# EAGLE design sanfrancisco_barometer_rev_B (EAGLE 6.6.0)
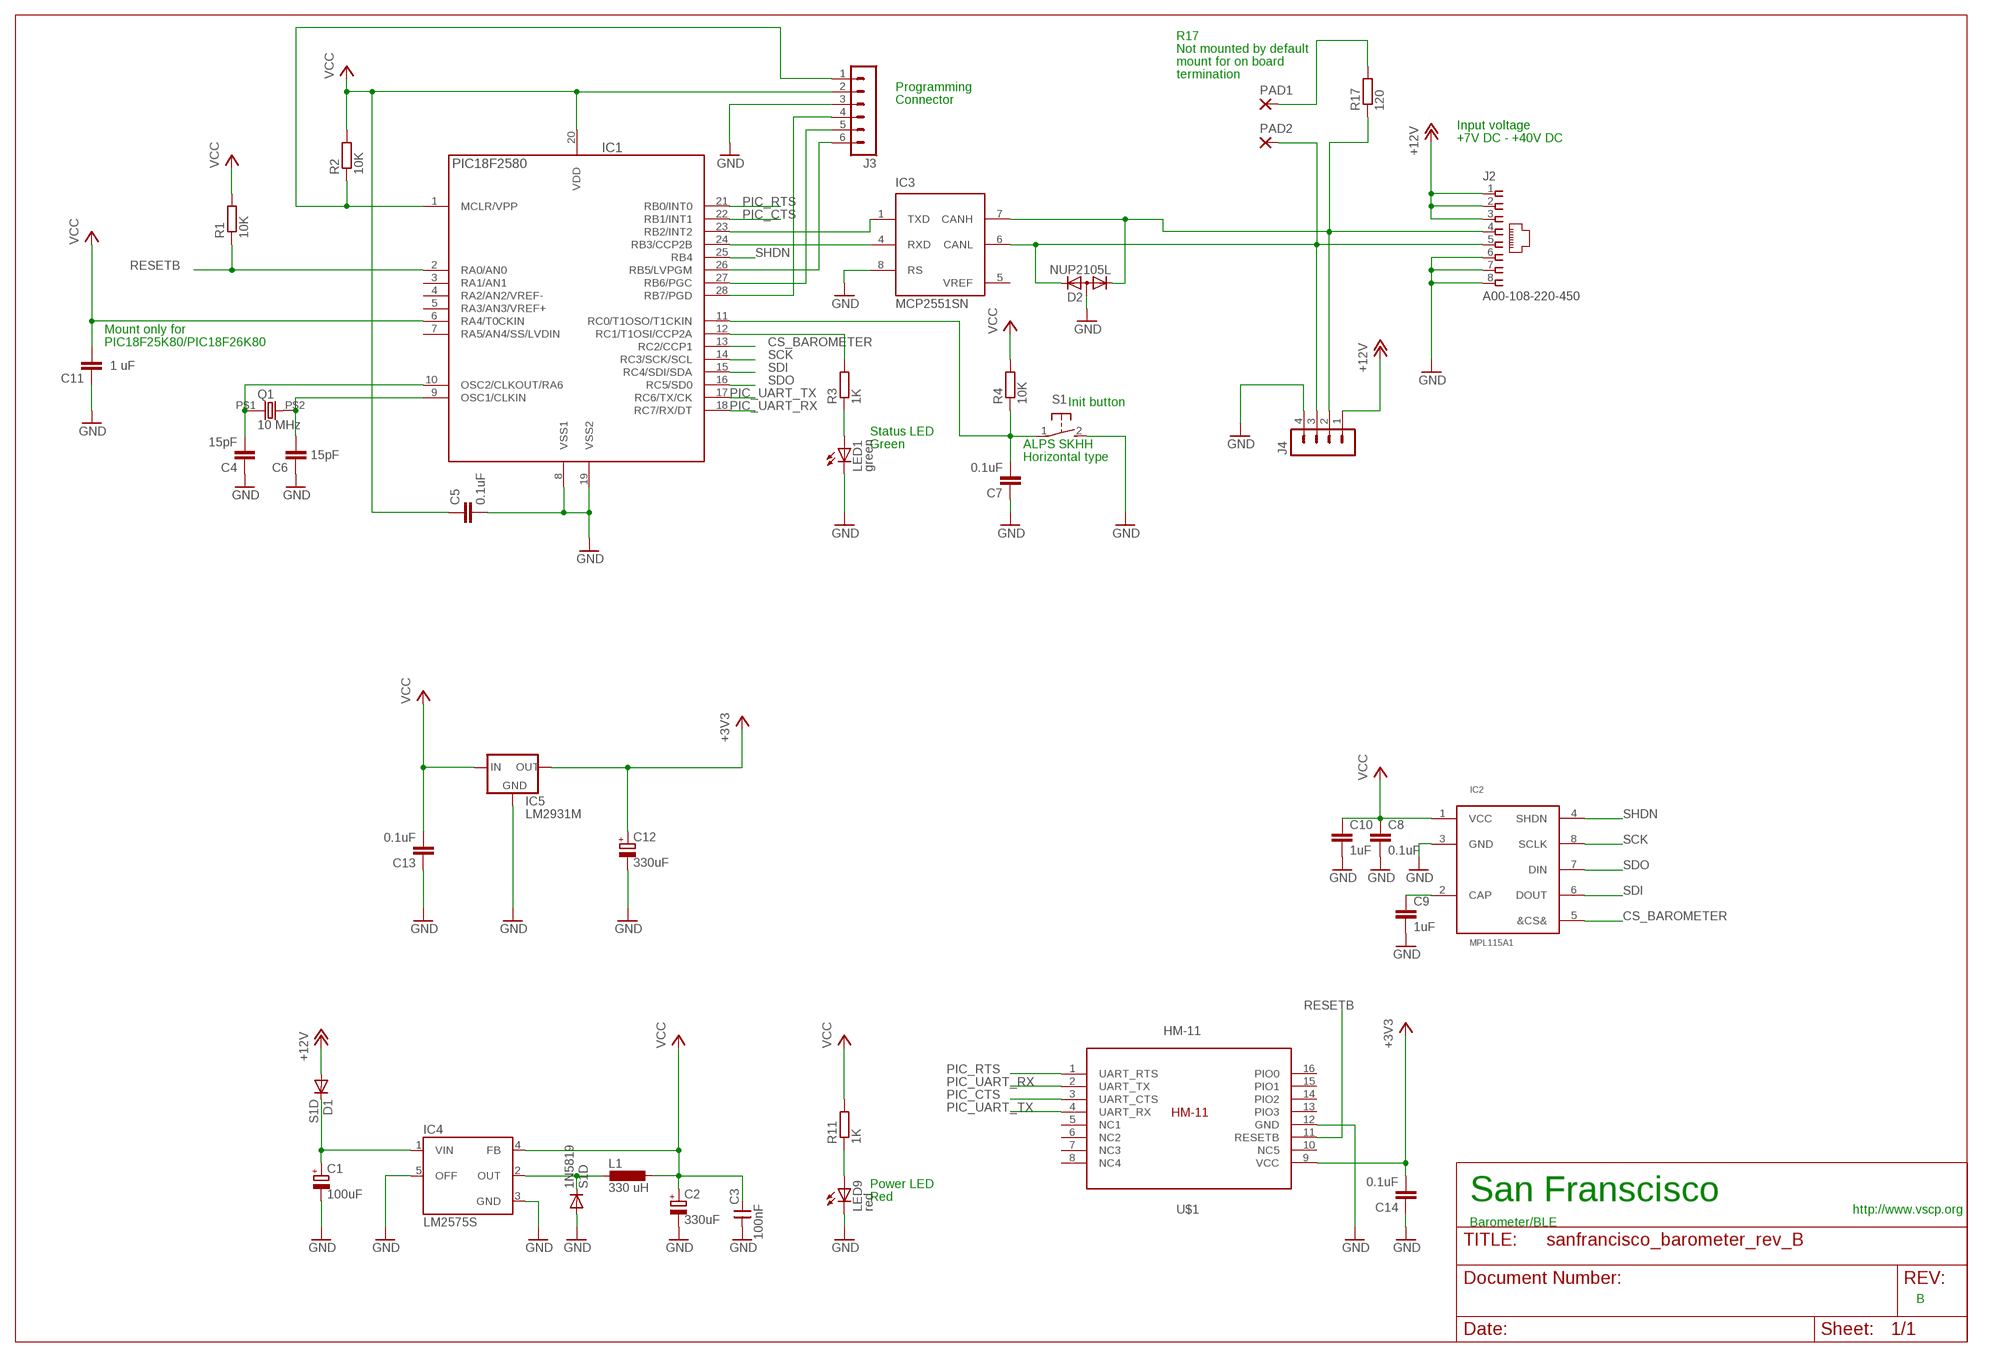
[diagram p0: schematic, sheet 1]

## Parts
1N5819  S1D  DIODE-SOD123  [SOD123]
C1  100uF  CPOL-EUD  [PANASONIC_D]
C2  330uF  CPOL-EUD  [PANASONIC_D]
C3  100nF  CNP-0805  [0805]
C4  15pF  C-EUC0805  [C0805]
C5  0.1uF  C-EUC0805  [C0805]
C6  15pF  C-EUC0805  [C0805]
C7  0.1uF  C-EUC0805  [C0805]
C8  0.1uF  C-EUC0805  [C0805]
C9  1uF  C-EUC0805  [C0805]
C10  1uF  C-EUC0805  [C0805]
C11  1 uF  C-EUC0805  [C0805]
C12  330uF  CPOL-EUD  [PANASONIC_D]
C13  0.1uF  C-EUC0805  [C0805]
C14  0.1uF  C-EUC0805  [C0805]
D1  S1D  DIODE-SOD123  [SOD123]
D2  NUP2105L  DIODE-2CA|ACSOT23  [SOT23]
IC1  PIC18F2580  PIC18LF252-I/SO  [SO28]
IC2  MPL115A1  [LGA8]
IC3  MCP2551SN  [SO-08]
IC4  LM2575S  [TO263-5]
IC5  LM2931M  [SO08]
J2  A00-108-220-450  [RJ-45]
J3  MA06-1  [MA06-1]
J4  MA04-1  [MA04-1]
L1  330 uH  DO3316P  [DO3316P]
LED1  green  LEDCHIP-LED0805  [CHIP-LED0805]
LED9  red  LEDCHIP-LED0805  [CHIP-LED0805]
PAD1  1,6/0,8  [1,6/0,8]
PAD2  1,6/0,8  [1,6/0,8]
Q1  10 MHz  HC-49S  [9C]
R1  10K  R-EU_R0805  [R0805]
R2  10K  R-EU_R0805  [R0805]
R3  1K  R-EU_R0805  [R0805]
R4  10K  R-EU_R0805  [R0805]
R11  1K  R-EU_R0805  [R0805]
R17  120  R-EU_R0805  [R0805]
S1  31-XX  [B3F-31XX]
U$1  HM-11  [HM-11]

## Nets
+3V3: C12.+ C14.2 IC5.1(OUT) U$1.9(VCC)
+12V: D1.A J2.1 J2.2 J2.3 J4.1
CANL: D2.2(K2) IC3.6(CANL) J2.5 J4.3 PAD2.1(P)
CS_BAROMETER: IC1.13(RC2/CCP1) IC2.5(&CS&)
GND: 1N5819.A C1.- C2.- C3.1 C4.1 C5.2 C6.1 C7.1 C8.2 C9.2 C10.2 C11.1 C12.- C13.1 C14.1 D2.3(A) IC1.8(VSS1) IC1.19(VSS2) IC2.3(GND) IC3.8(RS) IC4.3(GND) IC4.5(OFF) IC5.2(GND) J2.6 J2.7 J2.8 J3.3 J4.4 LED1.C LED9.C S1.2(S) U$1.12(GND)
N$1: 1N5819.C IC4.2(OUT) L1.1
N$2: C4.2 IC1.10(OSC2/CLKOUT/RA6) Q1.P$1
N$3: C1.+ D1.C IC4.1(VIN)
N$4: IC1.12(RC1/T1OSI/CCP2A) R3.2
N$5: LED1.A R3.1
N$6: C7.2 IC1.11(RC0/T1OSO/T1CKIN) R4.1 S1.1(P)
N$7: C6.2 IC1.9(OSC1/CLKIN) Q1.P$2
N$9: C9.1 IC2.2(CAP)
N$12: IC1.1(MCLR/VPP) J3.1 R2.1
N$13: IC1.28(RB7/PGD) J3.4
N$14: IC1.27(RB6/PGC) J3.5
N$15: IC1.26(RB5/LVPGM) J3.6
N$16: PAD1.1(P) R17.2
N$20: LED9.A R11.1
N$22: D2.1(K1) IC3.7(CANH) J2.4 J4.2 R17.1
PIC_CTS: IC1.22(RB1/INT1) U$1.3(UART_CTS)
PIC_RTS: IC1.21(RB0/INT0) U$1.1(UART_RTS)
PIC_UART_RX: IC1.18(RC7/RX/DT) U$1.2(UART_TX)
PIC_UART_TX: IC1.17(RC6/TX/CK) U$1.4(UART_RX)
RESETB: IC1.2(RA0/AN0) R1.1 U$1.11(RESETB)
RXCAN: IC1.24(RB3/CCP2B) IC3.4(RXD)
SCK: IC1.14(RC3/SCK/SCL) IC2.8(SCLK)
SDI: IC1.15(RC4/SDI/SDA) IC2.6(DOUT)
SDO: IC1.16(RC5/SD0) IC2.7(DIN)
SHDN: IC1.25(RB4) IC2.4(SHDN)
TXCAN: IC1.23(RB2/INT2) IC3.1(TXD)
VCC: C2.+ C3.2 C5.1 C8.1 C10.1 C11.2 C13.2 IC1.6(RA4/T0CKIN) IC1.20(VDD) IC2.1(VCC) IC4.4(FB) IC5.8(IN) J3.2 L1.2 R1.2 R2.2 R4.2 R11.2
Unconnected: IC1.3(RA1/AN1) IC1.4(RA2/AN2/VREF-) IC1.5(RA3/AN3/VREF+) IC1.7(RA5/AN4/SS/LVDIN) U$1.5(NC1) U$1.6(NC2) U$1.7(NC3) U$1.8(NC4) U$1.10(NC5) U$1.13(PIO3) U$1.14(PIO2) U$1.15(PIO1) U$1.16(PIO0)

## Notes on the sheet
- R17
- Not mounted by default
- mount for on board
- termination
- Programming
- Connector
- Input voltage
- +7V DC - +40V DC
- Mount only for
- PIC18F25K80/PIC18F26K80
- Init button
- Status LED
- Green | ALPS SKHH
- Horizontal type
- Power LED
- Red | San Franscisco
- http://www.vscp.org
- Barometer/BLE
- B

## Power pins joined to a net without a drawn wire
GND: IC3.2(VSS)
VCC: IC3.3(VDD)
VREF: IC3.5(VREF)

## Library data of the parts
1N5819 D1 = diode:DIODE-: DIODE
C1 C2 C12 = rcl:CPOL-EU: POLARIZED CAPACITOR, European symbol
C3 = cap-master:CNP-: NON-POLARIZED CAP
C4-C11 C13 C14 = rcl:C-EU: CAPACITOR, European symbol
D2 = diode:DIODE-2CA|AC: Dual DIODE Cathode-Anode|Anode-Cathode
IC1 = pic_olin:PIC18*F252-?: 18F252, 28 pin, 32Kb prog, 1536 data, 256 EEPROM
IC2 = mpl115a1:MPL115A1
IC3 = microchip_can:MCP2551: High Speed CAN tranceiver
IC4 = v-reg-3:LM2575: National Semiconductor <http://www.national.com> 1.0A "Simple Switcher"(c) 52kHz, Vout 1.23-37V (HV: 57V), Vin 40V (HV: 60V), 50µA standby current
IC5 = v-reg-3:LM2931: National Semiconductor <http://www.national.com> Low Dropout Fixed Regulator Vin up to 26V, Reverse Batterie/Load Dump/Short Circuit/Overload Protection,
J2 = vscpcan:A00-108-220-450
J3 = con-lstb:MA06-1: PIN HEADER; OC_FARNELL: unknown; OC_NEWARK: unknown
J4 = con-lstb:MA04-1: PIN HEADER; OC_FARNELL: unknown; OC_NEWARK: unknown
L1 = inductor-coilcraft:DO3316P: COILCRAFT; OC_FARNELL: unknown; OC_NEWARK: unknown
LED1 LED9 = led:LED: LED OSRAM: - CHIPLED LG R971, LG N971, LY N971, LG Q971, LY Q971, LO R971, LY R971 LH N974, LH R974 LS Q976, LO Q976, LY Q976 LO Q996 - Hyper CHIPLED LW Q18S LB Q993, LB Q99A, LB R99A - SideLED LS A670, LO A670, LY A670, LG A670, LP A670 LB A673, LV A673, LT A673, LW A673 LH A674 LY A675 LS A676, LA A676, LO A676, LY A676, LW A676 LS A679, LY A679, LG A679 - Hyper Micro SIDELED® LS Y876, LA Y876, LO Y876, LY Y876 LT Y87S - SmartLED LW L88C, LW L88S LB L89C, LB L89S, LG L890 LS L89K, LO L89K, LY L89K LS L896, LA L896, LO L896, LY L896 - TOPLED LS T670, LO T670, LY T670, LG T670, LP T670 LSG T670, LSP T670, LSY T670, LOP T670, LYG T670 LG T671, LOG T671, LSG T671 LB T673, LV T673, LT T673, LW T673 LH T674 LS T676, LA T676, LO T676, LY T676, LB T676, LH T676, LSB T676, LW T676 LB T67C, LV T67C, LT T67C, LS T67K, LO T67K, LY T67K, LW E67C LS E67B, LA E67B, LO E67B, LY E67B, LB E67C, LV E67C, LT E67C LW T67C LS T679, LY T679, LG T679 LS T770, LO T770, LY T770, LG T770, LP T770 LB T773, LV T773, LT T773, LW T773 LH T774 LS E675, LA E675, LY E675, LS T675 LS T776, LA T776, LO T776, LY T776, LB T776 LHGB T686 LT T68C, LB T68C - Hyper Mini TOPLED® LB M676 - Mini TOPLED Santana® LG M470 LS M47K, LO M47K, LY M47K Source: http://www.osram.convergy.de LUXEON: - LUMILED® LXK2-PW12-R00, LXK2-PW12-S00, LXK2-PW14-U00, LXK2-PW14-V00 LXK2-PM12-R00, LXK2-PM12-S00, LXK2-PM14-U00 LXK2-PE12-Q00, LXK2-PE12-R00, LXK2-PE12-S00, LXK2-PE14-T00, LXK2-PE14-U00 LXK2-PB12-K00, LXK2-PB12-L00, LXK2-PB12-M00, LXK2-PB14-N00, LXK2-PB14-P00, LXK2-PB14-Q00 LXK2-PR12-L00, LXK2-PR12-M00, LXK2-PR14-Q00, LXK2-PR14-R00 LXK2-PD12-Q00, LXK2-PD12-R00, LXK2-PD12-S00 LXK2-PH12-R00, LXK2-PH12-S00 LXK2-PL12-P00, LXK2-PL12-Q00, LXK2-PL12-R00 Source: www.luxeon.com KINGBRIGHT: KA-3528ASYC Source: www.kingbright.com
PAD1 PAD2 = wirepad:1,6/0,8: THROUGH-HOLE PAD
Q1 = vscpcan:HC-49S: Digikey 887-1050-1-nd
R1-R4 R11 R17 = rcl:R-EU_: RESISTOR, European symbol
S1 = switch-omron:31-XX: OMRON SWITCH; MPN: B3F-3100; OC_FARNELL: 959704; OC_NEWARK: 36M3582
U$1 = ble-hm-11:HM-11

## Board
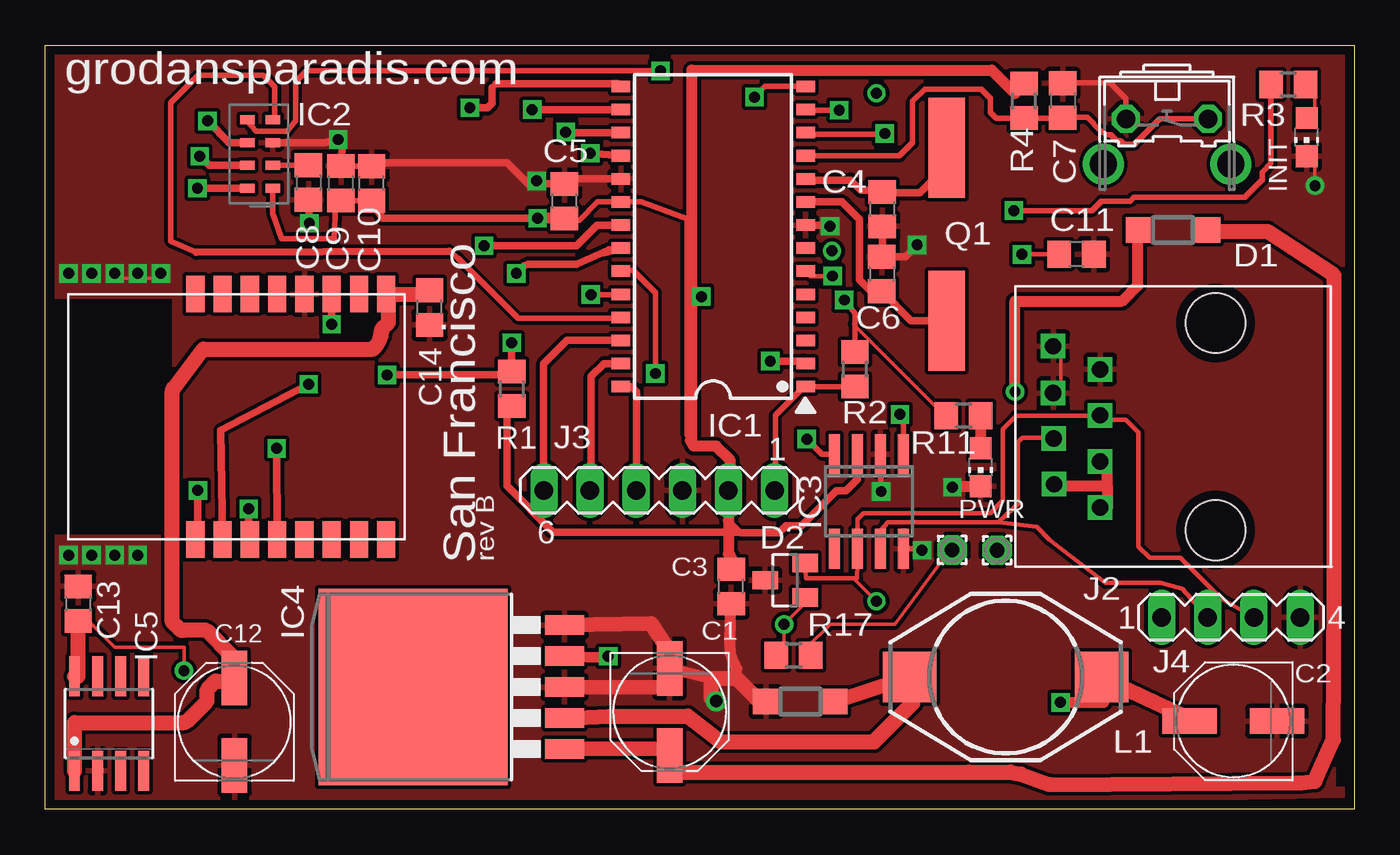
[diagram p1: board, top side]
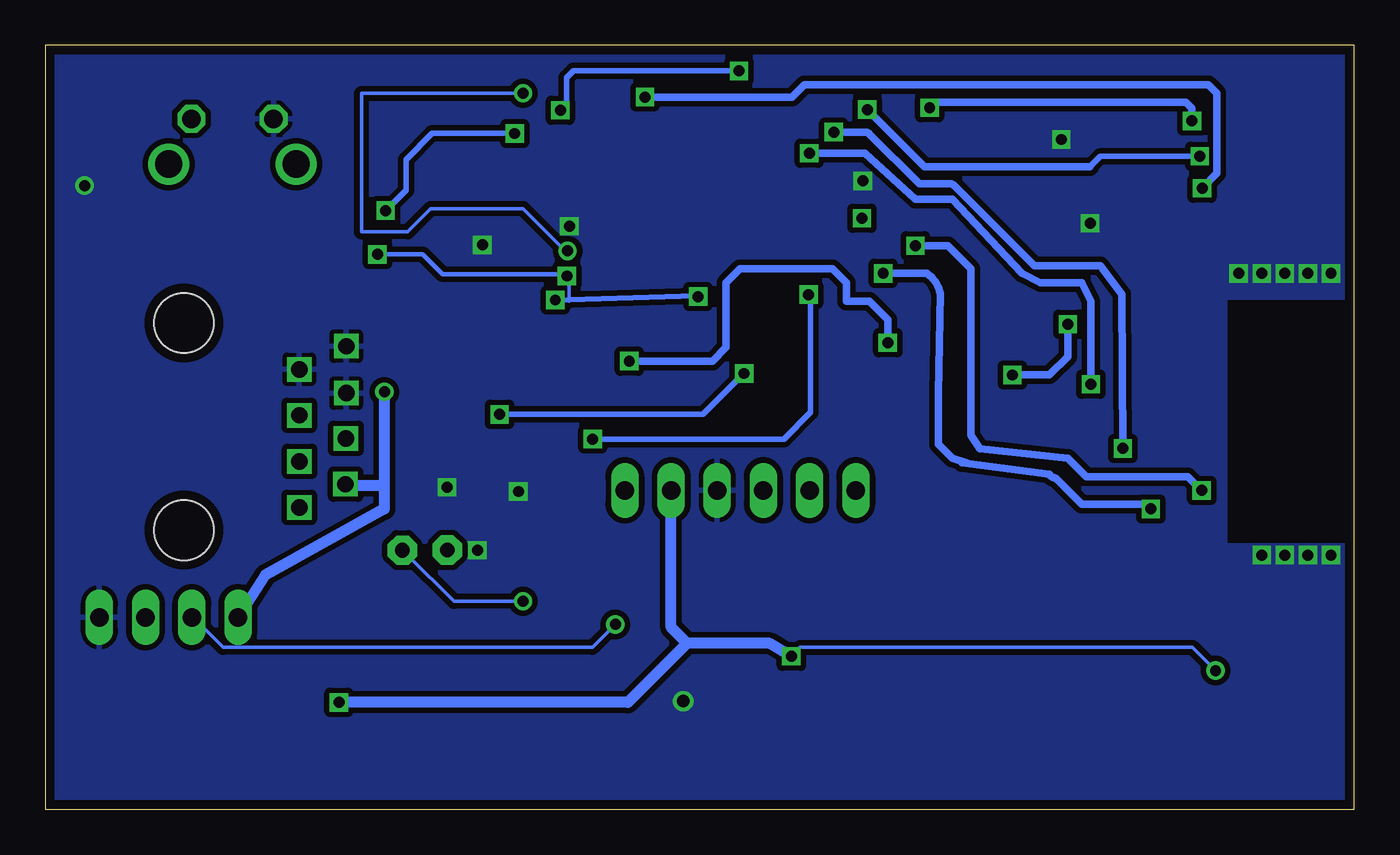
[diagram p2: board, bottom side, seen from below]

Size 72 x 42 mm. Coordinates in mm from the lower left corner, seen from the top.
Outline: 0,0 0,42 72,42 72,0 0,0
Copper layers (1*16): Top 0.035mm / dielectric 1.5mm / Bottom 0.035mm
Design rules "8mils": minimum track width 8mil, minimum drill 0.6mm, track to track 8mil, track to pad 8mil, pad to pad 8mil, via to via 8mil, smd to smd 0mil, copper to edge 20mil, drill to drill 10mil, minimum pad ring 8mil, minimum via ring 8mil, stop-mask expansion 0mil, vias tented up to drill 0mil, thermal gap 10mil

### Footprints (pad centres in the part's own frame; a part is rotated, then mirrored left to right if it is on the bottom)
SOD123 = smd 1.4 x 1.4: A 1.9,0; C -1.9,0
PANASONIC_D = smd 3 x 1.4: + 2.4,0; - -2.4,0
0805 = smd 1.27 x 1.524: 1 -0.953,0; 2 0.953,0
C0805 = smd 1.3 x 1.5: 1 -0.95,0; 2 0.95,0
SOT23 = smd 1 x 1.4: 1 -0.95,-1.1; 2 0.95,-1.1; 3 0,1.1
SO28 = smd 0.635 x 1.016: 1 -8.255,-5.08; 2 -6.985,-5.08; 3 -5.715,-5.08; 4 -4.445,-5.08; 5 -3.175,-5.08; 6 -1.905,-5.08; 7 -0.635,-5.08; 8 0.635,-5.08; 9 1.905,-5.08; 10 3.175,-5.08; 11 4.445,-5.08; 12 5.715,-5.08; 13 6.985,-5.08; 14 8.255,-5.08; 15 8.255,5.08; 16 6.985,5.08; 17 5.715,5.08; 18 4.445,5.08; 19 3.175,5.08; 20 1.905,5.08; 21 0.635,5.08; 22 -0.635,5.08; 23 -1.905,5.08; 24 -3.175,5.08; 25 -4.445,5.08; 26 -5.715,5.08; 27 -6.985,5.08; 28 -8.255,5.08
LGA8 = smd 0.8 x 0.5: 1 0,1.875; 2 0,0.625; 3 0,-0.625; 4 0,-1.875; 5 1.4,-1.875; 6 1.4,-0.625; 7 1.4,0.625; 8 1.4,1.875
SO-08 = smd 0.6 x 2.2: 1 -1.905,-2.6; 2 -0.635,-2.6; 3 0.635,-2.6; 4 1.905,-2.6; 5 1.905,2.6; 6 0.635,2.6; 7 -0.635,2.6; 8 -1.905,2.6
TO263-5 = smd 1.067 x 2.159: 1 -3.404,-5.791; 2 -1.702,-5.791; 3 0,-5.791; 4 1.702,-5.791; 5 3.404,-5.791 | smd 10.8 x 10.41: 6 0,2.54
SO08 = smd 0.6 x 2.2: 1 -1.905,-2.6; 2 -0.635,-2.6; 3 0.635,-2.6; 4 1.905,-2.6; 5 1.905,2.6; 6 0.635,2.6; 7 -0.635,2.6; 8 -1.905,2.6
RJ-45 = drill 0.9 square: 1 -4.45,6.35; 2 -3.17,8.89; 3 -1.92,6.36; 4 -0.65,8.91; 5 0.62,6.35; 6 1.84,8.93; 7 3.14,6.35; 8 4.42,8.93 | hole 3.3: -5.7,0; 5.7,0
MA06-1 = drill 1.016 long: 1 -6.35,0; 2 -3.81,0; 3 -1.27,0; 4 1.27,0; 5 3.81,0; 6 6.35,0
MA04-1 = drill 1.016 long: 1 -3.81,0; 2 -1.27,0; 3 1.27,0; 4 3.81,0
DO3316P = smd 2.92 x 2.79: 1 -5.28,0; 2 5.28,0
CHIP-LED0805 = smd 1.2 x 1.2: A 0,-1.05; C 0,1.05
1,6/0,8 = drill 0.813 pad 1.6 octagon: 1 0,0
9C = smd 5.5 x 2: P$1 -4.74,0; P$2 4.76,0
R0805 = smd 1.3 x 1.5: 1 -0.95,0; 2 0.95,0
B3F-31XX = drill 1.016 octagon: 1 -2.261,-1.245; 2 2.261,-1.245 | drill 1.499 pad 2.159: 3 -3.505,1.245; 4 3.505,1.245
HM-11 = smd 2 x 1: 1 -6.75,2.25; 2 -6.75,0.75; 3 -6.75,-0.75; 4 -6.75,-2.25; 5 -6.75,-3.75; 6 -6.75,-5.25; 7 -6.75,-6.75; 8 -6.75,-8.25; 9 6.75,-8.25; 10 6.75,-6.75; 11 6.75,-5.25; 12 6.75,-3.75; 13 6.75,-2.25; 14 6.75,-0.75; 15 6.75,0.75; 16 6.75,2.25

### Placement (x,y rotation side)
1N5819  41.53,5.91 180 top
C1  34.34,5.34 270 top
C2  65.36,4.84 180 top
C3  37.73,12.25 90 top
C4  46.04,33 90 top
C5  28.55,33.44 90 top
C6  46.01,29.43 270 top
C7  55.97,38.97 270 top
C8  16.26,34.42 90 top
C9  14.47,34.46 270 top
C10  17.94,34.41 90 top
C11  56.73,30.52 180 top
C12  10.4,4.8 90 top
C13  1.8,11.3 270 top
C14  21.13,27.58 90 top
D1  62.04,31.86 180 top
D2  40.7,12.59 90 top
IC1  36.74,31.49 90 top
IC2  12.51,36.03 180 top
IC3  45.31,16.93 180 top
IC4  22.77,6.71 90 top
IC5  3.5,4.7 0 top
J2  64.38,21.04 90 top
J3  33.77,17.53 180 top
J4  65.22,10.55 0 top
L1  52.83,7.26 0 top
LED1  69.39,36.96 180 top
LED9  51.45,18.8 180 top
PAD1  49.89,14.25 0 top
PAD2  52.36,14.24 0 top
Q1  49.58,31.63 270 top
R1  25.65,23.11 270 top
R2  44.54,24.19 90 top
R3  68.38,39.85 180 top
R4  53.84,38.95 90 top
R11  50.51,21.64 180 top
R17  41.16,8.46 0 top
S1  61.71,36.72 180 top
U$1  10.5,21.58 90 top

### Tracks (layer width: path | path; a pad name or v marks a point on that pad's centre or on a via)
+3V3
  Top 0.813: IC5.1 arc90 IC5.1 1.6,4.75 7.57,4.75 arc45 7.79,4.84 8.89,5.94 8.89,6.45 arc-45 8.98,6.67 9.35,7.04 10.1,7.04 arc45 10.33,7.13 C12.+ 10.4,8.16 arc45 10.31,8.39 8.87,9.83 7.57,9.83 arc-45 7.35,9.92 6.99,10.29 6.99,22.96 arc-45 7.08,23.18 8.69,25.3 18.03,25.3 arc45 18.51,26.41 18.87,26.77 18.87,28.07 arc45 18.78,28.3 U$1.9 20.8,28.33 arc45 21.02,28.42 C14.2
+12V  (via drill 0.6)
  Top 0.203: J2.2 55.88,17.78
  Top 0.406: D1.A 59.82,31.84
  Top 0.61: 55.88,17.78 58.42,17.78 | 58.42,17.78 58.42,19.05 J2.3 | 58.42,17.78 58.42,16.51 J2.1 | v53.35,22.95 53.34,27.94 59.25,27.94 60.11,28.8 60.11,31.83 D1.A
  Bottom 0.61: 53.34,17.78 53.34,16.51 59.9,12.87 J4.1 | 53.34,17.78 v53.35,22.95 v53.36,22.95 | 53.34,17.78 55.88,17.78 J2.2
CANL  (via drill 0.6)
  Top 0.203: v45.72,11.43 44.45,12.7 44.45,12.69
  Top 0.254: J4.3 64.7,11.57 62.44,13.83 60.75,13.83 60.14,14.44 60.14,20.72 59.45,21.41 58.28,21.41 J2.5 58.01,21.64 53.42,21.64 52.68,20.9 52.68,16.98 51.98,16.28 45.01,16.28 44.67,15.95 IC3.6 44.69,14.31 44.66,12.69 44.45,12.69 41.84,12.7 D2.2
  Bottom 0.203: v45.72,11.43 49.53,11.43 52.07,13.97 PAD2.1
CS_BAROMETER  (via drill 0.6)
  Top 0.305: IC2.5 11.11,37.84 11.58,37.27 13.29,37.27 13.77,37.85 13.77,39.99 14.38,40.6 v33.84,40.6 | v43.67,38.44 41.85,38.44 IC1.13
  Bottom 0.305: v33.84,40.6 42.94,40.6 43.32,40.22 43.32,38.79 v43.67,38.44
GND  (via drill 0.6, 0.7)
  Top 0.203: v69.85,34.29 69.85,35.56 LED1.C | J2.6 55.88,22.86 55.88,25.4 J2.8 | C10.2 17.78,35.56 | 5.08,29.21 3.81,29.21 v3.81,29.46 | 5.08,29.21 6.35,29.21 v6.35,29.46 | 5.08,29.21 v5.08,29.46 | 48.26,13.97 v48.23,14.24
  Top 0.254: 36.63,7.18 36.63,7.36
  Top 0.305: IC3.8 48.14,14.33 v48.23,14.24 | v45.98,17.47 45.98,19.5 IC3.2 | S1.2 59.45,39.06 58.55,39.96 56.01,39.96 C7.1 | C10.2 15.88,35.36 C8.2 | v14.52,32.22 14.51,32.18
  Top 0.406: IC1.19 28.82,34.66 C5.2 27.19,34.39 v27.03,34.55 26.67,34.29 25.4,35.56 17.78,35.56 | 45.97,32.12 C4.1 46.04,30.41 C6.1 47.31,30.38 v47.96,31.03 | IC1.8 43.1,32.12 v43.17,32.06 | IC2.3 15.36,36.66 v16.1,36.83 16.33,36.34 C8.2 | 14.51,32.18 C9.2
  Top 0.61: 34.65,6.72 34.33,6.65 34.62,7.21 34.65,7.18 | 34.65,7.18 34.7,7.13 | 34.65,7.18 C1.- | 39.42,5.79 39.33,5.88 1N5819.A 39.48,5.91 | C1.- 36.63,7.18 | 39.48,5.91 39.58,5.81 | 39.48,5.91 38.93,6.46 | 34.44,7.15 34.34,7.05 | C1.- 34.44,7.15 | 34.47,8.45 34.47,7.18 34.44,7.15 | 36.63,6.09 v36.91,5.94 | 38.02,7.18 38.02,7.75 37.69,8.54 37.65,9.27 C3.1 | LED9.C 49.95,17.75 v49.9,17.7
  Top 0.813: IC4.3 34.65,6.72 | 39.33,5.88 38.02,7.18 36.63,7.18 36.63,6.09 | IC4.5 33.34,10.21 34.47,8.45
  other vias: 1.27,29.46 2.54,29.46 1.27,13.97 2.54,13.97 3.81,13.97 5.08,13.97
  pour Bottom (isolate 0.305): -0.3,1.58 1.36,-1.77 71.34,-2.14 73.38,1.23 73.1,34.4 71.52,43.66 0.13,43.56 -0.79,28.14 7.11,28.14 7.11,14.48 0,14.48 0,14.73
  pour Top: 0.65,40.5 0.51,28.45 0.51,28.19 7.11,28.19 7.11,14.73 6.86,14.73 6.86,14.99 0.51,14.99 0.51,-0.76 0.64,-0.76 71.44,0.73 71.44,1.13 70.87,1.13 70.87,41.43 32.17,41.43 32.17,41.03
  pour Top: 0.22,42.04 0.51,42.04 0.51,28.19 7.11,28.19 7.11,14.73 0.51,14.73 0.22,-1.43 72.92,-1.43 72.92,43.04
N$1
  Top 0.61: 47.83,5.86 47.78,5.91 L1.1 47.71,5.81 | IC4.2 28.65,4.95 28.53,4.89
  Top 0.813: L1.1 1N5819.C | 47.71,5.81 45.6,3.7 37.16,3.7 35.35,5.11 31.02,5.1 28.61,5 28.65,4.95
N$2
  Top 0.406: Q1.P$1 49.58,35.37 48.1,33.89 45.66,33.89 45.52,34.03 | 45.52,34.03 45.96,34.03 C4.2 | 45.52,34.03 44.87,34.03 44.3,34.6 41.88,34.6 IC1.10
N$3
  Top 0.406: 34.35,3.36 C1.+ 34.79,2.03 | D1.C 64.48,31.86 64.58,31.76
  Top 0.813: IC4.1 34.35,3.36 | 64.58,31.76 67.25,31.76 70.91,29.35 70.91,11.94 70.87,3.81 69.85,1.52 69.09,1.44 68.66,1.44 55.27,1.34 53.68,1.93 53.1,2.04 50.79,2.03 34.79,2.03
N$4  (via drill 0.6)
  Top 0.305: IC1.12 41.92,37.2 42.01,37.12 46.14,37.12 v46.18,37.16 | v53.28,32.92 57.58,32.92 58.1,33.44 59.69,33.44 59.89,33.64 65.98,33.64 66.96,34.62 66.96,35.04 67.43,35.51 R3.2
  Bottom 0.305: v46.18,37.16 50.73,37.16 52.17,35.72 52.17,34.03 v53.28,32.92
N$5
  Top 0.203: 69.85,39.37 69.85,38.1 LED1.A
  Top 0.254: 69.85,39.37 R3.1
N$6
  Top 0.305: IC1.11 41.84,35.92 46.99,35.92 47.71,36.64 47.71,38.92 48.39,39.6 51.49,39.6 51.98,39.11 51.98,38.33 52.31,38 R4.1 55.95,38 C7.2 55.99,38.04 57.32,38.04 58.07,37.29 58.13,37.29 58.33,37.09 58.62,37.09 58.95,36.76 59.14,36.76 59.33,36.57 59.92,36.57 61.31,37.97 S1.1
N$7
  Top 0.406: Q1.P$2 47.62,26.87 C6.2 45.41,28.48 44.78,29.11 44.78,32.45 43.83,33.4 IC1.9
N$9
  Top 0.305: C9.1 IC2.2
N$12
  Top 0.305: IC1.1 R2.1 41.74,23.24 40.16,21.66 40.16,17.57 J3.1
N$13
  Top 0.305: 32.24,23.23 IC1.28 | J3.4 32.52,17.55
  Top 0.406: 32.24,23.23 32.52,22.96 32.52,17.55
N$14
  Top 0.305: J3.5 30.03,17.6
  Top 0.406: IC1.27 30.73,24.5 30.03,23.8 30.03,17.6
N$15
  Top 0.305: J3.6
  Top 0.406: IC1.26 28.68,25.77 27.41,24.5 J3.6
N$16
  Top 0.203: R17.2 41.91,8.89 43.18,10.16 46.74,10.16 49.53,13.97 PAD1.1
N$20
  Top 0.61: R11.1 LED9.A
N$21  (via drill 0.6)
  Bottom 0.203: v45.72,39.37 54.61,39.37 54.61,31.75 52.07,31.75 50.8,33.02 45.72,33.02 43.18,30.48 v43.27,30.7
N$22  (via drill 0.6)
  Top 0.203: 53.28,16.57 53.34,16.51 | D2.1 41.91,11.43 v40.64,10.16 40.64,8.89 R17.1
  Top 0.254: IC3.7 45.95,15.3 46.34,15.79 52.43,15.79 | 52.43,15.79 53.28,16.57 53.51,16.78 53.51,20.17 53.76,20.42 55.44,20.42 J2.4 | J4.2 62.56,12.12 61.34,12.44 58.33,12.44 55.23,14.81 54.56,15.52 52.43,15.79
  Bottom 0.203: v40.64,10.16 41.91,8.89 62.23,8.89 63.5,10.16 J4.2
PIC_CTS  (via drill 0.6)
  Top 0.305: 30.73,30.6 arc45 31.02,30.76 | 26.55,29.97 arc45 26.32,29.88 | 11.18,15.01 arc45 U$1.3
  Top 0.406: IC1.22 30.73,30.6 | 31.02,30.76 29.21,29.97 26.55,29.97 | 26.32,29.88 v25.91,29.46 | v11.18,16.51 11.18,15.01
  Bottom 0.305: 11.56,16.76 arc45 11.34,16.67
  Bottom 0.406: v25.91,29.46 23.5,29.46 arc45 22.77,28.36 22.86,22.86 22.86,20.07 22.1,19.3 21.34,19.05 21.59,19.05 16.76,18.42 arc-45 16.42,18.2 14.99,16.76 11.56,16.76 | 11.34,16.67 v11.18,16.51
PIC_RTS  (via drill 0.6)
  Top 0.406: IC1.21 30.35,32.12 29.21,30.99 v24.13,30.99 | v8.38,17.53 8.38,14.96 U$1.1
  Bottom 0.406: v24.13,30.99 22.35,30.99 21.08,29.72 21.08,20.57 20.57,19.81 15.75,19.3 14.73,18.29 9.14,18.29 v8.38,17.53
PIC_UART_RX  (via drill 0.6)
  Top 0.406: IC1.18 v29.97,36.07 | v14.48,23.37 9.65,20.83 U$1.2
  Bottom 0.406: v29.97,36.07 26.92,36.07 24.13,33.53 22.1,33.53 18.29,29.46 17.27,28.96 14.99,28.96 14.48,27.94 v14.48,23.37
PIC_UART_TX  (via drill 0.6)
  Top 0.305: 28.7,37.2 arc-45 v28.63,37.24
  Top 0.406: IC1.17 28.7,37.2 | v12.72,19.84 U$1.4
  Bottom 0.406: v28.63,37.24 26.9,37.24 arc45 26.68,37.14 23.93,34.39 22.23,34.39 arc45 22,34.3 17.58,29.87 13.97,29.87 12.78,28.32 v12.72,19.84
RESETB  (via drill 0.6)
  Top 0.406: U$1.11 v15.75,26.67 | v18.8,23.88 25.47,23.88 R1.1 v25.65,25.65 | v39.88,24.64 41.69,24.64 IC1.2
  Bottom 0.406: v15.75,26.67 15.75,24.89 16.76,23.88 v18.8,23.88 | v25.65,25.65 25.65,26.92 26.67,27.94 27.94,27.94 27.94,28.96 28.7,29.72 33.78,29.72 34.54,28.96 34.54,25.4 35.31,24.64 v39.88,24.64
RXCAN  (via drill 0.6)
  Top 0.305: IC3.4 42.71,19.53 v41.89,20.35 | v30.01,28.3 31.64,28.3 IC1.24
  Bottom 0.305: v41.89,20.35 31.37,20.35 29.9,21.82 29.9,28.19 v30.01,28.3
SCK  (via drill 0.6)
  Top 0.305: IC1.14 39.59,39.74 v39.01,39.16 | IC2.8
  Top 0.406: v8.36,34.15 IC2.8
  Bottom 0.406: v39.01,39.16 30.94,39.16 30.25,39.85 8.02,39.85 7.54,39.37 7.54,34.97 v8.36,34.15
SDI  (via drill 0.6)
  Top 0.305: 24.57,39.68 24.79,39.9 | 31.5,39.9 IC1.15
  Top 0.406: IC2.6 10.12,36.66 v8.92,37.85 | v23.35,38.57 24.33,38.57 24.57,38.81 24.57,39.68 | 24.79,39.9 31.5,39.9
  Bottom 0.406: v8.92,37.85 8.92,38.54 9.27,38.89 23.03,38.89 v23.35,38.57
SDO  (via drill 0.6)
  Top 0.305: IC1.16
  Top 0.406: IC2.7 8.99,35.41 v8.49,35.91 | v26.78,38.47 IC1.16
  Bottom 0.305: v8.49,35.91 13.95,35.91 14.54,35.32
  Bottom 0.406: 14.54,35.32 23.63,35.32 v26.78,38.47
SHDN
  Top 0.305: 22.2,30.68 22.7,30.3 26,27 31.61,27 IC1.25 | 8.29,30.63 6.9,31.24 6.9,38.85 8.41,40.36 11.98,40.36 12.62,39.72 12.62,38.02 IC2.4
  Top 0.406: 8.29,30.63 22.2,30.68
TXCAN  (via drill 0.6)
  Top 0.305: IC3.1 47.22,21.5 v47.01,21.71 | v33.56,23.96 33.56,28.41 32.32,29.65 31.73,29.65 IC1.23
  Bottom 0.305: v47.01,21.71 35.81,21.71 v33.56,23.96
VCC  (via drill 0.6)
  Top 0.203: R11.2 49.53,21.59 44.45,26.67 44.54,26.67 | v7.62,7.62 7.62,8.89 3.81,8.89 2.54,10.16 C13.2 | 25.4,21.59 R1.2 | 38.1,15.24 38.16,15.29
  Top 0.254: 35.48,20.27 35.56,20.32 | C11.2 v53.74,30.52 v53.73,30.51 | v43.31,29.32 42.09,29.32 IC1.6
  Top 0.305: C5.1 28.65,32.39 29.38,32.39 30.39,33.4 IC1.20 32.77,33.4 35.3,32.48 35.3,28.08 | 35.3,28.08 35.3,20.58 35.48,20.27 | J3.2 37.68,17.63 | 30.86,8.36 v30.96,8.41 | 37.58,15.87 38.16,15.29 38.26,15.19 | 58.23,5.87 L1.2 | R2.2 44.54,26.67 44.54,27.28 v43.95,28 | v36.09,28.19 35.41,28.19 35.3,28.08 | IC2.1 12.51,32.77 13,31.36 15.87,31.36 15.95,32.58 15.95,33.39 C8.1 17.58,33.47 C10.1
  Top 0.406: 63.05,4.95 C2.+ | IC3.3 44.67,18.14 44.03,17.5 43.51,17.5 41.59,15.58 40.74,15.58 40.35,15.19 38.26,15.19 | v27.08,32.5 18.55,32.5 C10.1 | 25.4,21.59 25.4,17.78 27.94,15.24 38.1,15.24
  Top 0.61: 35.48,20.27 35.66,19.96 36.9,19.96 37.68,19.18 37.68,17.63 | IC4.4 30.86,8.36 | C3.2 37.72,13.9 37.58,14.04 37.58,15.87 J3.2 | C5.1 v27.09,32.49 v27.08,32.5 | v55.85,5.87 58.23,5.87 | 35.56,20.32 35.56,40.64 52.07,40.64 53.34,39.37 R4.2
  Top 0.813: L1.2 63.05,4.95 | IC5.8 1.8,7.3 C13.2
  Bottom 0.203: v43.31,29.32 43.18,29.21 43.18,27.94 43.18,28.02 | v7.62,7.62 8.89,8.89 30.48,8.89 v30.96,8.41
  Bottom 0.254: v53.73,30.51 51.26,30.51 50.16,29.41 43.4,29.41 v43.31,29.32
  Bottom 0.305: v43.95,28 43.18,28.02 36.14,28.24 v36.09,28.19
  Bottom 0.61: J3.2 37.58,9.99 36.71,9.12 | 36.71,9.12 32.14,9.12 v30.96,8.41 | v55.85,5.87 39.96,5.87 36.71,9.12

### Text on the board
tNames: grodansparadis.com | INIT | PWR | San Francisco | rev B